# Altium schematic sheet mcu.SchDoc
size A4; DrawnBy: Forrest Gu; DocumentNumber: 1; Revision: 1.0; SheetNumber: 1; SheetTotal: 5
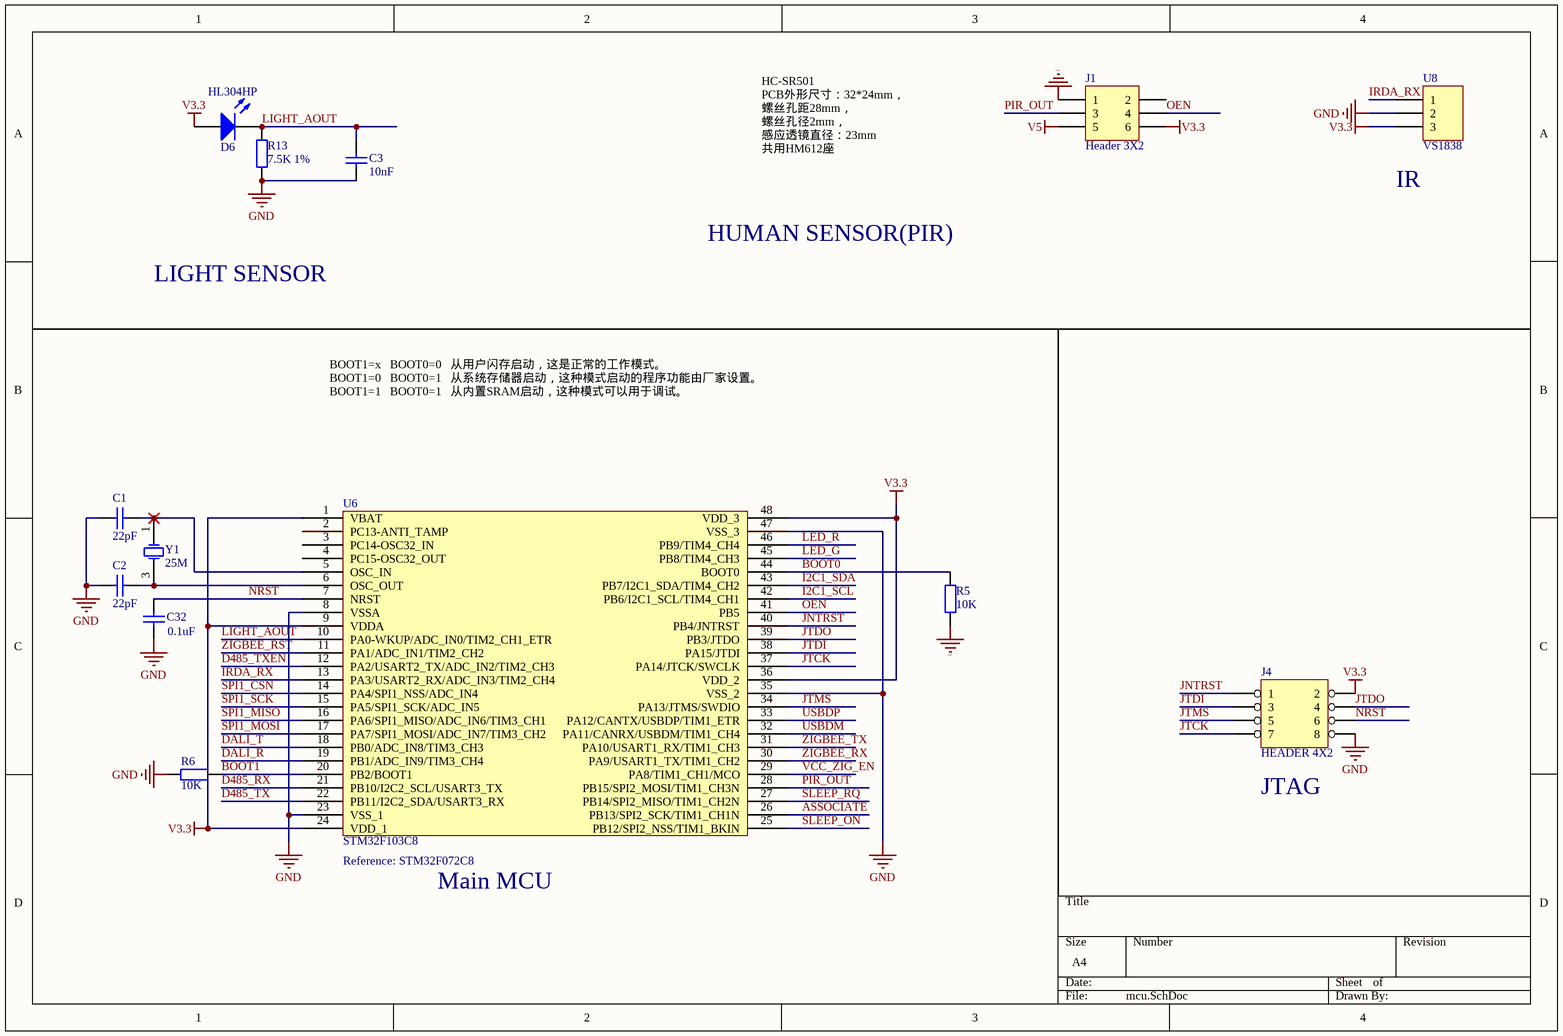
[diagram p0: mcu.SchDoc]

## Parts
C1  22pF  [0603]
C2  22pF  [0603]
C3  10nF  [0603]
C32  0.1uF  [0603]
D6  HL304HP  [LED_A2]
J1  Header 3X2  [HC-SR501-V1]
J4  HEADER 4X2  [HDR2X4]
R5  10K  [0603R]
R6  10K  [0603R]
R13  7.5K 1%  [0603R]
U6  STM32F103C8  [LQFP48S]
U8  VS1838  [HDR1X3]
Y1  25M  [3225]

## Nets
GND: C1.1 C2.1 C3.1 C32.1 J1.1 J4.8 R5.2 R6.1 R13.2 U6.8(VSSA) U6.23(VSS_1) U6.35(VSS_2) U6.47(VSS_3) U8.2
V3.3: D6.1(A) J1.6 J4.2 U6.1(VBAT) U6.9(VDDA) U6.24(VDD_1) U6.36(VDD_2) U6.48(VDD_3) U8.3
V5: J1.5
ASSOCIATE: U6.26(PB13/SPI2_SCK/TIM1_CH1N)
BOOT0: R5.1 U6.44(BOOT0)
BOOT1: R6.2 U6.20(PB2/BOOT1)
D485_RX: U6.21(PB10/I2C2_SCL/USART3_TX)
D485_TX: U6.22(PB11/I2C2_SDA/USART3_RX)
D485_TXEN: U6.12(PA2/USART2_TX/ADC_IN2/TIM2_CH3)
DALI_R: U6.19(PB1/ADC_IN9/TIM3_CH4)
DALI_T: U6.18(PB0/ADC_IN8/TIM3_CH3)
I2C1_SCL: U6.42(PB6/I2C1_SCL/TIM4_CH1)
I2C1_SDA: U6.43(PB7/I2C1_SDA/TIM4_CH2)
IRDA_RX: U6.13(PA3/USART2_RX/ADC_IN3/TIM2_CH4) U8.1
JNTRST: J4.1 U6.40(PB4/JNTRST)
JTCK: J4.7 U6.37(PA14/JTCK/SWCLK)
JTDI: J4.3 U6.38(PA15/JTDI)
JTDO: J4.4 U6.39(PB3/JTDO)
JTMS: J4.5 U6.34(PA13/JTMS/SWDIO)
LED_G: U6.45(PB8/TIM4_CH3)
LED_R: U6.46(PB9/TIM4_CH4)
LIGHT_AOUT: C3.2 D6.2(K) R13.1 U6.10(PA0-WKUP/ADC_IN0/TIM2_CH1_ETR)
NRST: C32.2 J4.6 U6.7(NRST)
OEN: J1.4 U6.41(PB5)
PIR_OUT: J1.3 U6.28(PB15/SPI2_MOSI/TIM1_CH3N)
SLEEP_ON: U6.25(PB12/SPI2_NSS/TIM1_BKIN)
SLEEP_RQ: U6.27(PB14/SPI2_MISO/TIM1_CH2N)
SPI1_CSN: U6.14(PA4/SPI1_NSS/ADC_IN4)
SPI1_MISO: U6.16(PA6/SPI1_MISO/ADC_IN6/TIM3_CH1)
SPI1_MOSI: U6.17(PA7/SPI1_MOSI/ADC_IN7/TIM3_CH2)
SPI1_SCK: U6.15(PA5/SPI1_SCK/ADC_IN5)
USBDM: U6.32(PA11/CANRX/USBDM/TIM1_CH4)
USBDP: U6.33(PA12/CANTX/USBDP/TIM1_ETR)
VCC_ZIG_EN: U6.29(PA8/TIM1_CH1/MCO)
ZIGBEE_RST: U6.11(PA1/ADC_IN1/TIM2_CH2)
ZIGBEE_RX: U6.30(PA9/USART1_TX/TIM1_CH2)
ZIGBEE_TX: U6.31(PA10/USART1_RX/TIM1_CH3)
NetC1_2: C1.2 U6.5(OSC_IN) Y1.1(OSC1)
NetC2_2: C2.2 U6.6(OSC_OUT) Y1.3(OSC2)

Not connected (* = marked no-connect by the designer): J1 2; U6 2(PC13-ANTI_TAMP) 3(PC14-OSC32_IN) 4(PC15-OSC32_OUT)

## Notes on the sheet
- HC-SR501
  PCB外形尺寸：32*24mm，
  螺丝孔距28mm，
  螺丝孔径2mm，
  感应透镜直径：23mm
  共用HM612座
- HUMAN SENSOR(PIR)
- (near U8) IR
- LIGHT SENSOR
- BOOT1=x   BOOT0=0   从用户闪存启动，这是正常的工作模式。
  BOOT1=0   BOOT0=1   从系统存储器启动，这种模式启动的程序功能由厂家设置。
  BOOT1=1   BOOT0=1   从内置SRAM启动，这种模式可以用于调试。
- (near J4) JTAG
- (near U6) Reference: STM32F072C8
- (near U6) Main MCU

## Library data of the parts
C1 C2 C32 = Cap: Capacitor; Published: 8-Jun-2000; LatestRevisionDate: 17-Jul-2002; LatestRevisionNote: Re-released for DXP Platform.; PackageReference: RAD-0.3; Publisher: Altium Limited
  C1 C2: Value: 22pF
  C32: Value: 0.1uF
C3 = Cap: Capacitor; Value: 0.1uF; Published: 8-Jun-2000; LatestRevisionDate: 17-Jul-2002; LatestRevisionNote: Re-released for DXP Platform.; PackageReference: RAD-0.3; Publisher: Altium Limited
D6 = LED0: 3MM光敏传感器; Published: 8-Jun-2000; LatestRevisionDate: 08-Jul-2005; LatestRevisionNote: Mech Layer 1 removed.; PackageReference: LED-0; Publisher: Altium Limited
J1 = Header 3X2: Header, 3-Pin, Dual row; LatestRevisionDate: 17-Jul-2002; LatestRevisionNote: Re-released for DXP Platform.; Publisher: Altium Limited
R5 R6 R13 = Res2: Resistor; Value: 1K; Published: 8-Jun-2000; LatestRevisionDate: 17-Jul-2002; LatestRevisionNote: Re-released for DXP Platform.; PackageReference: AXIAL-0.4; Publisher: Altium Limited
U6 = STM32F103C6
U8 = Header 3: Header, 3-Pin; LatestRevisionDate: 17-Jul-2002; LatestRevisionNote: Re-released for DXP Platform.; Publisher: Altium Limited
Y1 = XTAL_4pin: Crystal Oscillator; Published: 8-Jun-2000; LatestRevisionDate: 17-Jul-2002; LatestRevisionNote: Re-released for DXP Platform.; PackageReference: R38; Publisher: Altium Limited